# Altium project Kelpie_Pi_Hat.PrjPcb
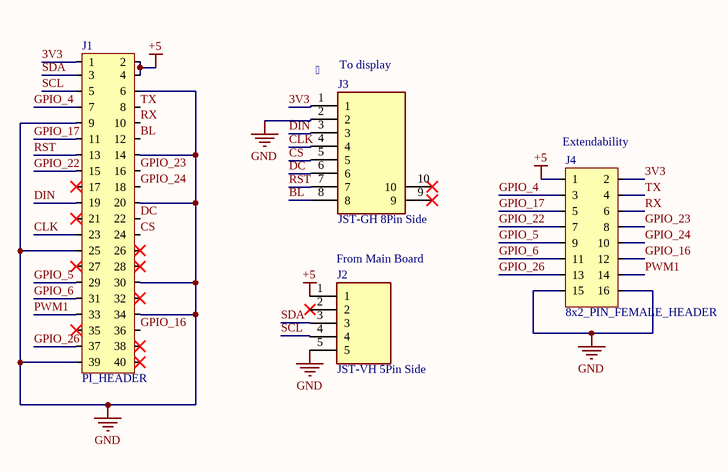
[diagram p0: Kelpie_Pi_hat_Schematic.SchDoc]
1 sheet, 4 parts. Net scope: global (net labels, ports and power ports of the same name join across sheets).
Board file: Kelpie_Pi_Hat.PcbDoc

## Sheet Kelpie_Pi_hat_Schematic.SchDoc
size A4; SheetNumber: 1; SheetTotal: 1

### Parts
J1  PI_HEADER  [PI_HEADER]
J2  JST-VH 5Pin Side  [B5PSVHLFSN]
J3  JST-GH 8Pin Side  [BM08BGHSTBTLFSN]
J4  8x2_PIN_FEMALE_HEADER  [8x2_PIN_FEMALE_HEADER]

### Nets
+5: J1.2 J1.4 J2.1 J4.1
GND: J1.6 J1.9 J1.14 J1.20 J1.25 J1.30 J1.34 J1.39 J2.5 J3.2 J4.15 J4.16
3V3: J1.1 J3.1 J4.2
BL: J1.12 J3.8
CLK: J1.23 J3.4
CS: J1.24 J3.5
DC: J1.22 J3.6
DIN: J1.19 J3.3
GPIO_4: J1.7 J4.3
GPIO_5: J1.29 J4.9
GPIO_6: J1.31 J4.11
GPIO_16: J1.36 J4.12
GPIO_17: J1.11 J4.5
GPIO_22: J1.15 J4.7
GPIO_23: J1.16 J4.8
GPIO_24: J1.18 J4.10
GPIO_26: J1.37 J4.13
PWM1: J1.33 J4.14
RST: J1.13 J3.7
RX: J1.10 J4.6
SCL: J1.5 J2.4
SDA: J1.3 J2.3
TX: J1.8 J4.4

Not connected (* = marked no-connect by the designer): J1 17* 21* 26* 27* 28* 32* 35* 38* 40*; J2 2*; J3 9* 10*

### Notes on the sheet
- (near J3) 
- (near J3) To display
- (near J4) Extendability
- (near J2) From Main Board

### Library data of the parts
J1 = PI_HEADER: 40 Pin (20x2) Pi Header (Adafruit 2243)
J2 = B5PS-VH_LF__SN_: Connector; Manufacturer_Name: JST (JAPAN SOLDERLESS TERMINALS); Manufacturer_Part_Number: B5PS-VH(LF)(SN); Datasheet Link: http://uk.rs-online.com/web/p/products/8201166; Height: 8.5mm; Arrow Part Number: B5PS-VH(LF)(SN); Arrow Price/Stock: https://www.arrow.com/en/products/b5ps-vh-lf-sn/jst-manufacturing?region=europe
J3 = BM08B-GHS-TBT_LF__SN_: Connector; Manufacturer_Name: JST (JAPAN SOLDERLESS TERMINALS); Manufacturer_Part_Number: BM08B-GHS-TBT(LF)(SN); Datasheet Link: http://www.jst-mfg.com/product/pdf/eng/eGH.pdf; Height: 4.05mm
J4 = 8x2_PIN_FEMALE_HEADER: https://core-electronics.com.au/0-100-2-54-mm-female-header-2x8-pin-straight.html